# EAGLE design irng.2.0 (EAGLE 6.3)
Assembly variants: 3cpu, proto
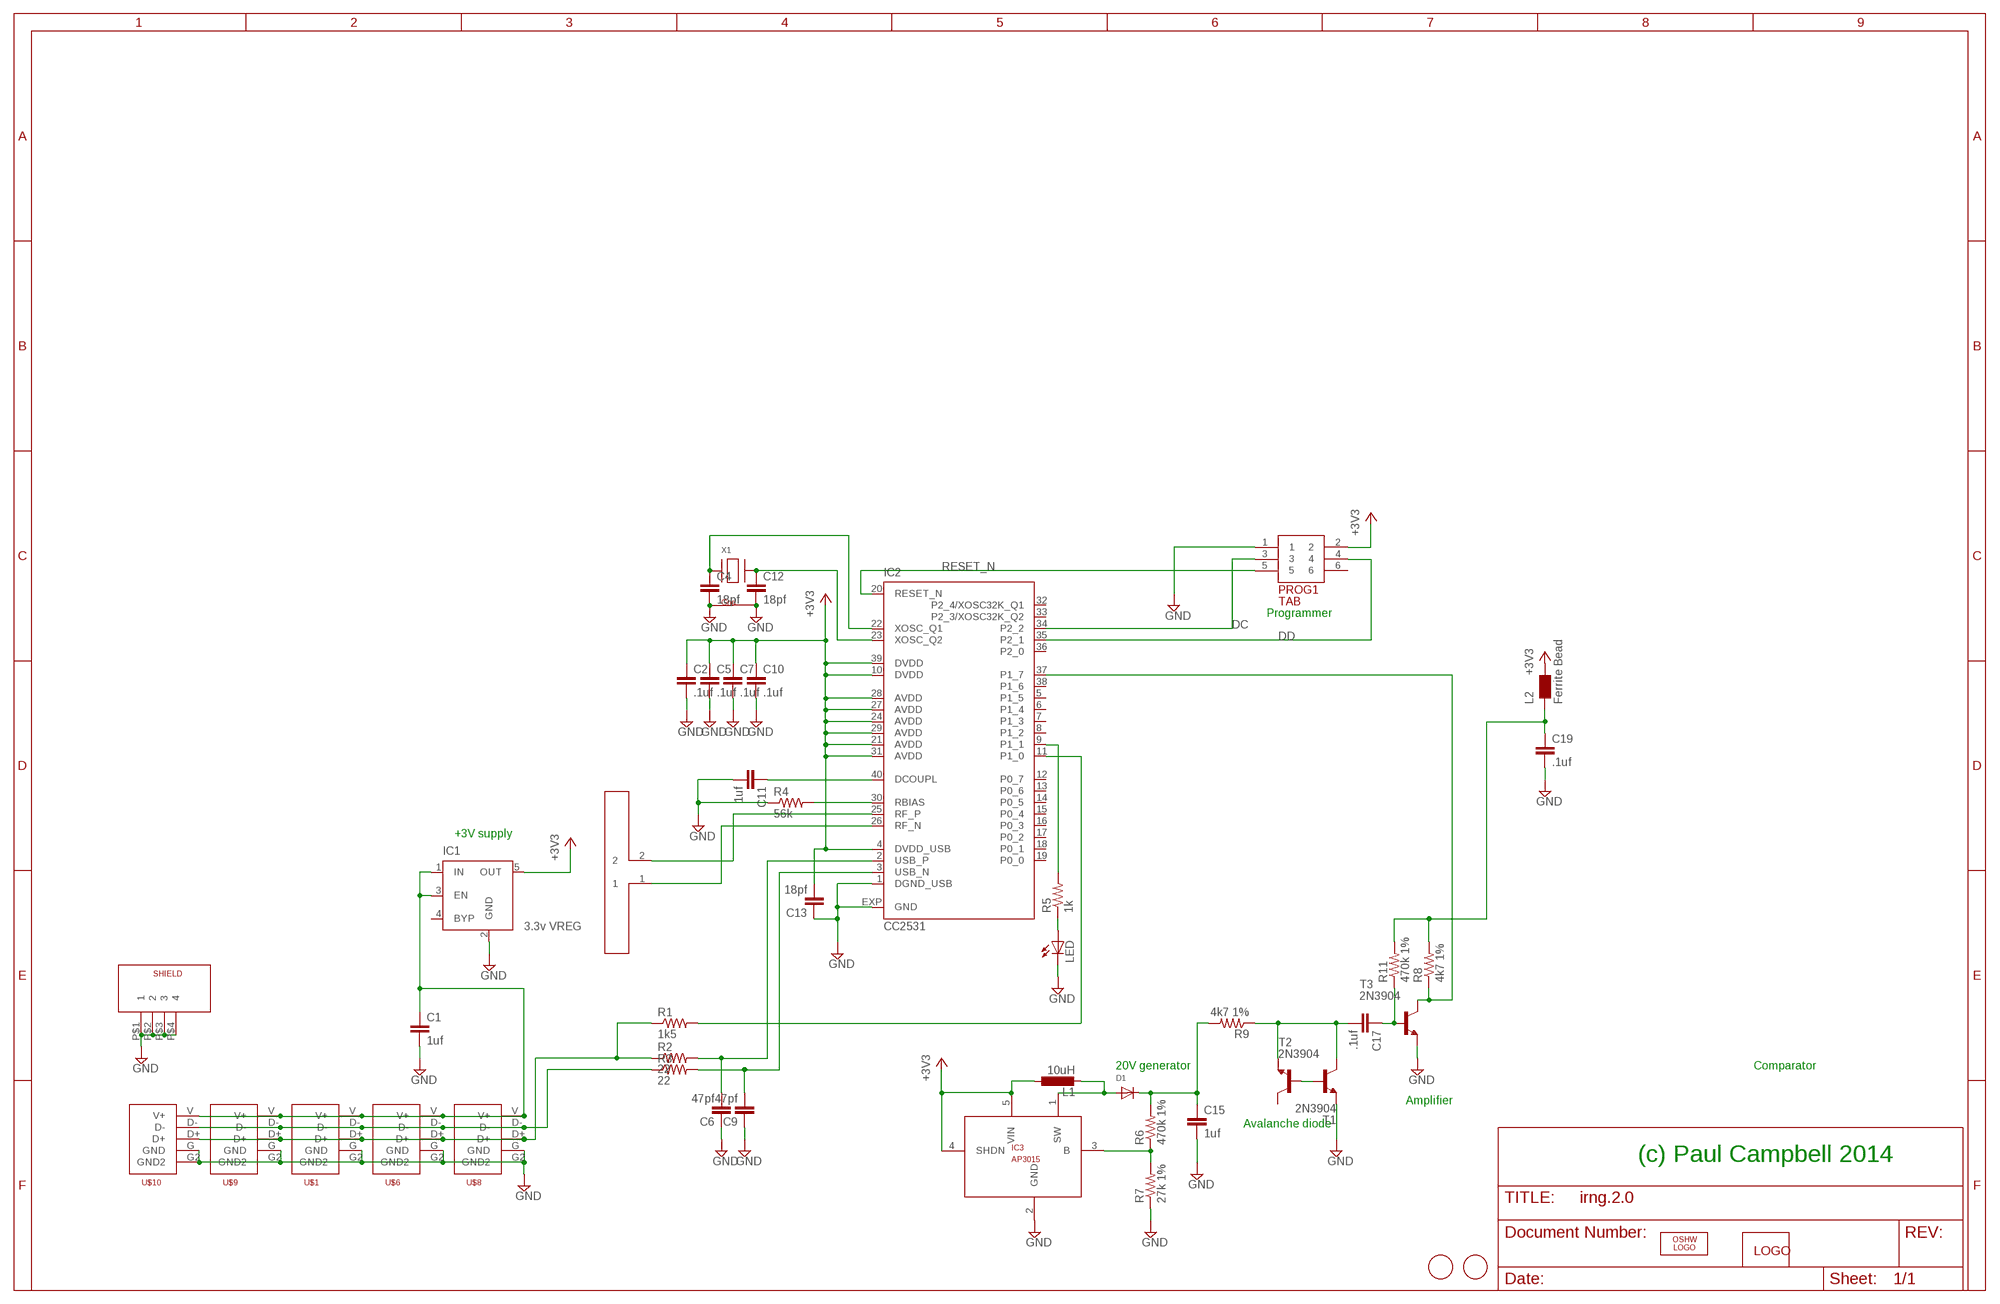
[diagram p0: schematic, sheet 1]

## Parts
C1  1uf  C-EUC0603  [C0603]
C2  .1uf  C-EUC0603  [C0603]
C4  18pf  C-EUC0603  [C0603]
C5  .1uf  C-EUC0603K  [C0603K]
C6  47pf  C-EUC0603  [C0603]
C7  .1uf  C-EUC0603  [C0603]
C9  47pf  C-EUC0603  [C0603]
C10  .1uf  C-EUC0603  [C0603]
C11  1uf  C-EUC0603  [C0603]
C12  18pf  C-EUC0603  [C0603]
C13  18pf  C-EUC0603  [C0603]
C15  1uf  C-EUC0603  [C0603]
C17  .1uf  C-EUC0603  [C0603]
C19  .1uf  C-EUC0603  [C0603]
D1  DIODESOD-323F  [SOD-323F]
IC1  3.3v VREG  MIC5219XX  [SOT23-5]
IC2  CC2531  [RHA_S-PVQFN-N40]
IC3  AP3015  AP3105  [SOT23-5]
L1  10uH  L-EUL2012C  [L2012C]
L2  Ferrite Bead  WE-CBF_0603  [0603]
LED  LEDCHIP-LED0805  [CHIP-LED0805]
LOGO1  OSHW_LOGO_FILLX0100-NT  [OSHW_FILLX100_NOTEXT]
PROG1  TAB  [TAG]
R1  1k5  R-US_R0603  [R0603]
R2  22  R-US_R0603  [R0603]
R3  22  R-US_R0603  [R0603]
R4  56k  R-US_R0603  [R0603]
R5  1k  R-US_R0603  [R0603]
R6  470k 1%  R-US_R0603  [R0603]
R7  27k 1%  R-US_R0603  [R0603]
R8  4k7 1%  R-US_R0603  [R0603]
R9  4k7 1%  R-US_R0603  [R0603]
R11  470k 1%  R-US_R0603  [R0603]
T1  2N3904  BCF32-NPN-SOT23-BEC  [SOT23-BEC]
T2  2N3904  BCF32-NPN-SOT23-BEC  [SOT23-BEC]
T3  2N3904  BCF32-NPN-SOT23-BEC  [SOT23-BEC]
U$1  USBPAD  [PAD4]
U$2  DIPOLE  [YSHORT-DIPOLE]
U$3  FIDUCIAL  [FIDUCIAL_1MM]
U$4  FIDUCIAL  [FIDUCIAL_1MM]
U$5  MOONBASE-LOGO  [MOONBASE-LOGO]
U$6  USBPAD  [PAD4]
U$7  SHIELD-NEW  [SHIELD-NEW]
U$8  USBPAD  [PAD4]
U$9  USBPAD  [PAD4]
U$10  USBPAD  [PAD4]
X1  XTAL-4-3225  [NX3225]

## Nets
+3V3: C2.1 C5.1 C7.1 C10.1 C13.2 IC1.5(OUT) IC2.4(DVDD_USB) IC2.10(DVDD) IC2.21(AVDD) IC2.24(AVDD) IC2.27(AVDD) IC2.28(AVDD) IC2.29(AVDD) IC2.31(AVDD) IC2.39(DVDD) IC3.4(SHDN) IC3.5(VIN) L1.1 L2.2 PROG1.2
DC: IC2.34(P2_2) PROG1.3
DD: IC2.35(P2_1) PROG1.4
GND: C1.2 C2.2 C4.2 C5.2 C6.1 C7.2 C9.1 C10.2 C11.2 C12.2 C13.1 C15.2 C19.2 IC1.2(GND) IC2.1(DGND_USB) IC2.EXP(GND) IC3.2(GND) LED.C PROG1.1 R4.1 R7.1 T2.E T3.E U$1.G2(GND2) U$1.G(GND) U$6.G2(GND2) U$6.G(GND) U$7.P$1 U$7.P$2 U$7.P$3 U$7.P$4 U$8.G2(GND2) U$8.G(GND) U$9.G2(GND2) U$9.G(GND) U$10.G2(GND2) U$10.G(GND) X1.2(G2) X1.4(G1)
N$1: T1.B T2.B
N$3: C6.2 IC2.2(USB_P) R2.2
N$4: R3.1 U$1.D- U$6.D- U$8.D- U$9.D- U$10.D-
N$5: C9.2 IC2.3(USB_N) R3.2
N$6: LED.A R5.1
N$7: R1.1 R2.1 U$1.D+ U$6.D+ U$8.D+ U$9.D+ U$10.D+
N$8: IC2.11(P1_0) R1.2
N$9: IC2.9(P1_1) R5.2
N$10: C11.1 IC2.40(DCOUPL)
N$11: IC2.37(P1_7) R8.1 T3.C
N$12: C1.1 IC1.1(IN) IC1.3(EN) U$1.V(V+) U$6.V(V+) U$8.V(V+) U$9.V(V+) U$10.V(V+)
N$13: C17.2 R9.1 T1.E T2.C
N$15: C17.1 R11.1 T3.B
N$16: C15.1 D1.C R6.2 R9.2
N$18: C4.1 IC2.22(XOSC_Q1) X1.1(X1)
N$19: C12.1 IC2.23(XOSC_Q2) X1.3(X2)
N$20: C19.1 L2.1 R8.2 R11.2
N$22: IC2.30(RBIAS) R4.2
N$24: IC2.25(RF_P) U$2.2
N$25: IC2.26(RF_N) U$2.1
N$27: D1.A IC3.1(SW) L1.2
R88: IC3.3(B) R6.1 R7.2
RESET_N: IC2.20(RESET_N) PROG1.5
Unconnected: IC1.4(BYP) IC2.5(P1_5) IC2.6(P1_4) IC2.7(P1_3) IC2.8(P1_2) IC2.12(P0_7) IC2.13(P0_6) IC2.14(P0_5) IC2.15(P0_4) IC2.16(P0_3) IC2.17(P0_2) IC2.18(P0_1) IC2.19(P0_0) IC2.32(P2_4/XOSC32K_Q1) IC2.33(P2_3/XOSC32K_Q2) IC2.36(P2_0) IC2.38(P1_6) PROG1.6 T1.C

## Notes on the sheet
- Programmer
- +3V supply
- 20V generator | Comparator
- Amplifier
- Avalanche diode
- (c) Paul Campbell 2014

## Library data of the parts
C1 C2 C4-C7 C9-C13 C15 C17 C19 = rcl:C-EU: CAPACITOR, European symbol
D1 = adafruit:DIODE: Diode SMADIODE - SMA Surface Mount Package 20V 1A Schottky Diode Digikey: 641-1014-6-ND DO-1N4148 - Through Hole Small Current Diode SOD-123 20V 1 A (.5mV Vf) Schottky Diode - Digikey: MBRX120TPMSCT-ND SOD-323 10V 570mA (.38mV Vf, 3ns) Schottky Diode - Digikey: ZLLS410CT-ND SOD-523 30V 30mA Schottky Diode (RB751S-40TE61) - Digikey: RB751S-40TE61CT-ND SOT23-R/W - SOT23 Package (R = Solder Paste/Reflow Ovens, W = Hand-Soldering) BAT54Film 40V 300mA - Digikey: 497-7162-1-ND
IC1 = v-reg-micrel:MIC5219XX: VOLTAGE REGULATOR
IC2 = texas:CC2531: A USB Enabled System-On-Chip Solution for 2.4-GHz IEEE 802.15.4 and ZigBee Source: http://focus.ti.com/lit/ds/symlink/cc2531.pdf; MPN: CC2531F256RHAT; OC_FARNELL: 1776351; OC_NEWARK: 34R2713
IC3 = playa:AP3105
L1 = rcl:L-EU: INDUCTOR, European symbol
L2 = wuerth-elektronik:WE-CBF: SMD EMI Suppression Ferrite Beads - excellent anti-EMI properties - low DCR - impedances till 3000 ohms - rated current up to 6 A
LED = adafruit:LED: LED OSRAM: - CHIPLED LG R971, LG N971, LY N971, LG Q971, LY Q971, LO R971, LY R971 LH N974, LH R974 LS Q976, LO Q976, LY Q976 LO Q996 - Hyper CHIPLED LW Q18S LB Q993, LB Q99A, LB R99A - SideLED LS A670, LO A670, LY A670, LG A670, LP A670 LB A673, LV A673, LT A673, LW A673 LH A674 LY A675 LS A676, LA A676, LO A676, LY A676, LW A676 LS A679, LY A679, LG A679 - Hyper Micro SIDELED® LS Y876, LA Y876, LO Y876, LY Y876 LT Y87S - SmartLED LW L88C, LW L88S LB L89C, LB L89S, LG L890 LS L89K, LO L89K, LY L89K LS L896, LA L896, LO L896, LY L896 - TOPLED LS T670, LO T670, LY T670, LG T670, LP T670 LSG T670, LSP T670, LSY T670, LOP T670, LYG T670 LG T671, LOG T671, LSG T671 LB T673, LV T673, LT T673, LW T673 LH T674 LS T676, LA T676, LO T676, LY T676, LB T676, LH T676, LSB T676, LW T676 LB T67C, LV T67C, LT T67C, LS T67K, LO T67K, LY T67K, LW E67C LS E67B, LA E67B, LO E67B, LY E67B, LB E67C, LV E67C, LT E67C LW T67C LS T679, LY T679, LG T679 LS T770, LO T770, LY T770, LG T770, LP T770 LB T773, LV T773, LT T773, LW T773 LH T774 LS E675, LA E675, LY E675, LS T675 LS T776, LA T776, LO T776, LY T776, LB T776 LHGB T686 LT T68C, LB T68C - Hyper Mini TOPLED® LB M676 - Mini TOPLED Santana® LG M470 LS M47K, LO M47K, LY M47K Source: http://www.osram.convergy.de/
LOGO1 = ohw-logo:OSHW_LOGO_FILL
PROG1 = br:TAB
R1-R9 R11 = rcl:R-US_: RESISTOR, American symbol
T1-T3 = transistor-neu-to92:*-NPN-: NPN Transistror
U$1 U$6 U$8-U$10 = playa:USBPAD
U$2 = playa:DIPOLE
U$3 U$4 = adafruit:FIDUCIAL: For use by pick and place machines to calibrate the vision/machine, 1mm By microbuilder.eu
U$5 = ll:MOONBASE-LOGO
U$7 = playa:SHIELD-NEW
X1 = adafruit:XTAL-4: Classic 4-pin 3.2 x 2.5mm crystal

## Board
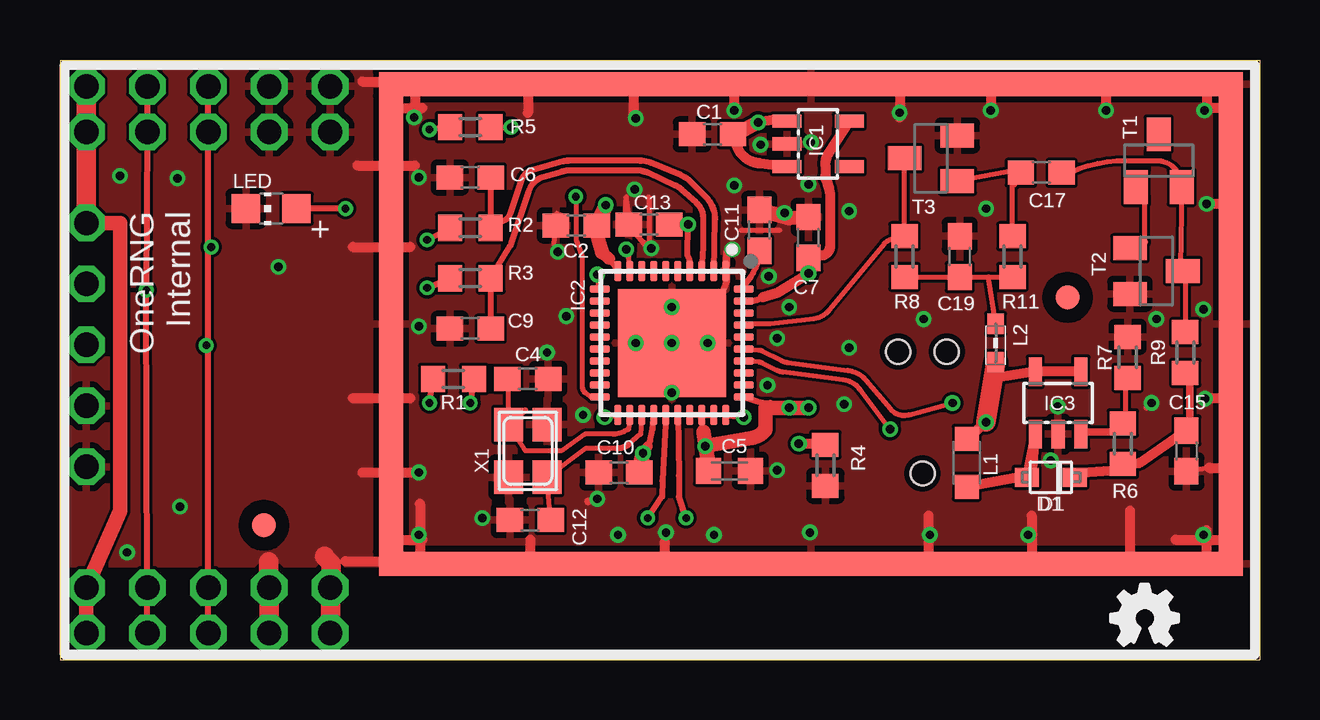
[diagram p1: board, top side]
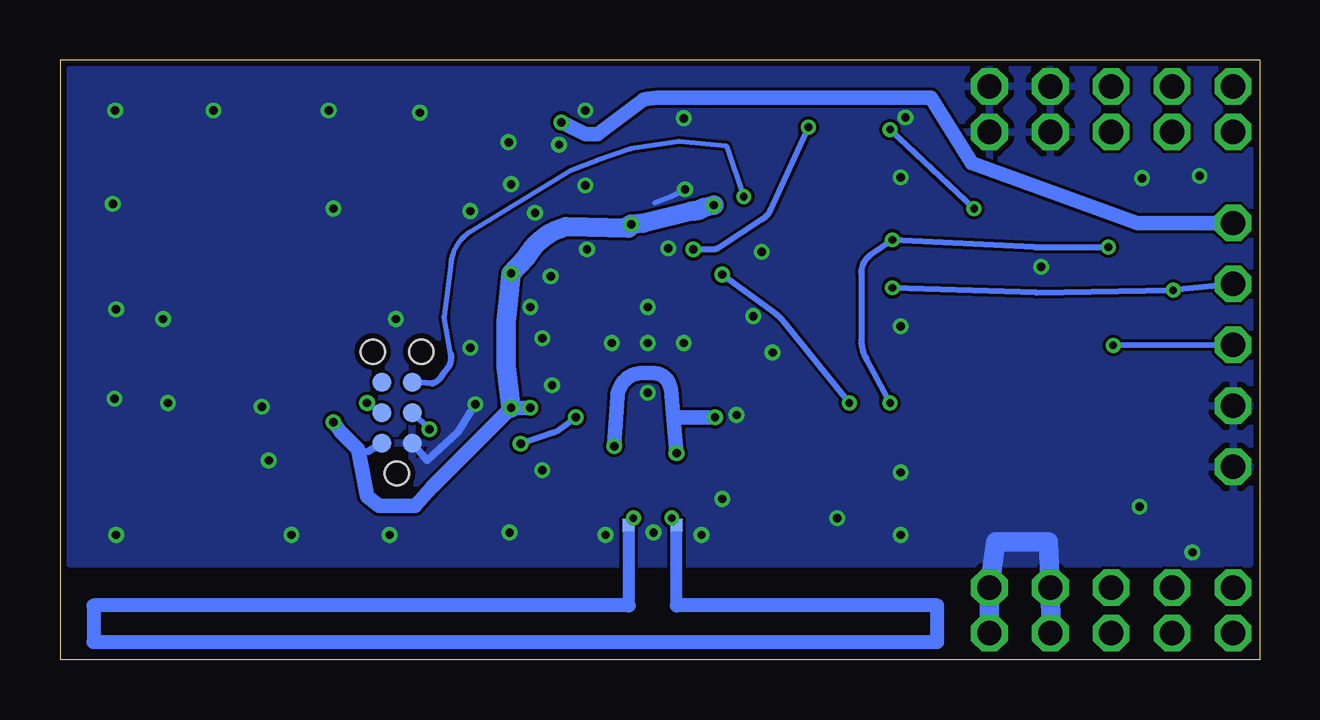
[diagram p2: board, bottom side, seen from below]

Size 50 x 25 mm. Coordinates in mm from the lower left corner, seen from the top.
Outline: 0,0 50,0 50,25 0,25 0,0
Copper layers (1*16): Top 0.035mm / dielectric 1.5mm / Bottom 0.035mm
Design rules "dirt_cheap_dirty_boards.v1": minimum track width 5mil, minimum drill 12mil, track to track 5mil, track to pad 5mil, pad to pad 5mil, via to via 5mil, smd to smd 0mil, copper to edge 10mil, drill to drill 10mil, minimum pad ring 10mil, minimum via ring 6mil, stop-mask expansion 2mil, vias tented up to drill 25mil, thermal gap 10mil

### Footprints (pad centres in the part's own frame; a part is rotated, then mirrored left to right if it is on the bottom)
C0603 = smd 1.1 x 1: 1 -0.85,0; 2 0.85,0
C0603K = smd 1.05 x 1.08: 1 -0.875,0; 2 0.875,0
SOD-323F = smd 1 x 0.8: A -1,0; C 1,0
SOT23-5 = smd 0.55 x 1.2: 1 -0.95,-1.3; 2 0,-1.3; 3 0.95,-1.3; 4 0.95,1.3; 5 -0.95,1.3
RHA_S-PVQFN-N40 = smd 0.85 x 0.3: 1 -3,2.25; 2 -3,1.75; 3 -3,1.25; 4 -3,0.75; 5 -3,0.25; 6 -3,-0.25; 7 -3,-0.75; 8 -3,-1.25; 9 -3,-1.75; 10 -3,-2.25; 21 3,-2.25; 22 3,-1.75; 23 3,-1.25; 24 3,-0.75; 25 3,-0.25; 26 3,0.25; 27 3,0.75; 28 3,1.25; 29 3,1.75; 30 3,2.25 | smd 0.3 x 0.85: 11 -2.25,-3; 12 -1.75,-3; 13 -1.25,-3; 14 -0.75,-3; 15 -0.25,-3; 16 0.25,-3; 17 0.75,-3; 18 1.25,-3; 19 1.75,-3; 20 2.25,-3; 31 2.25,3; 32 1.75,3; 33 1.25,3; 34 0.75,3; 35 0.25,3; 36 -0.25,3; 37 -0.75,3; 38 -1.25,3; 39 -1.75,3; 40 -2.25,3 | smd 4.5 x 4.5: EXP 0,0
L2012C = smd 1 x 1: 1 -1,0; 2 1,0
0603 = smd 0.85 x 0.7: 1 -0.9,0; 2 0.7,0
CHIP-LED0805 = smd 1.2 x 1.2: A 0,-1.05; C 0,1.05
TAG = smd 0.787 x 0.787 bottom: 1 -1.27,0.635; 2 -1.27,-0.635; 3 0,0.635; 4 0,-0.635; 5 1.27,0.635; 6 1.27,-0.635 | hole 1: -2.54,0; 2.54,1.016; 2.54,-1.016
R0603 = smd 1 x 1.1: 1 -0.85,0; 2 0.85,0
SOT23-BEC = smd 1 x 1.4: B -0.95,-1.1; C 0,1.1; E 0.95,-1.1
PAD4 = drill 1.016 octagon: D+ -5.08,0; D- -2.54,0; G -7.62,0; G2 -10.16,0; V 0,0
YSHORT-DIPOLE = smd 0.51 x 0.51 bottom: 1 -1,0; 2 1,0
FIDUCIAL_1MM = smd 1 x 1: 1 0,0
SHIELD-NEW = smd 1 x 20: P$1 17.5,0; P$2 -17.5,0 | smd 36 x 1: P$3 0,10; P$4 0,-10
NX3225 = smd 1.4 x 1.2: 1 -1.1,-0.8; 2 1.1,-0.8; 3 1.1,0.8; 4 -1.1,0.8

### Placement (x,y rotation side)
C1  27.2,21.9 180 top
C2  21.52,18.1 180 top
C4  19.5,11.7 0 top
C5  27.9,7.87 0 top
C6  17.1,20.1 0 top
C7  31.2,17.6 90 top
C9  17.1,13.8 0 top
C10  23.3,7.8 180 top
C11  29.15,17.9 90 top
C12  19.6,5.82 180 top
C13  24.55,18.13 0 top
C15  46.95,8.7 270 top
C17  40.9,20.3 0 top
C19  37.5,16.8 90 top
D1  41.3,7.6 0 top
IC1  31.6,21.5 270 top
IC2  25.5,13.2 270 top
IC3  41.6,10.7 0 top
L1  37.8,8.2 270 top
L2  39,13.1 270 top
LED  8.8,18.8 90 top
LOGO1  43.8,0.6 0 top
PROG1  35.95,10.3 90 top
R1  16.4,11.7 0 top
R2  17.1,18 0 top
R3  17.1,15.9 0 top
R4  31.9,8.1 90 top
R5  17.1,22.2 0 top
R6  44.3,9 270 top
R7  44.5,12.6 270 top
R8  35.2,16.8 270 top
R9  46.9,12.8 270 top
R11  39.7,16.8 270 top
T1  45.8,20.8 0 top
T2  45.7,16.2 270 top
T3  36.3,20.9 90 top
U$1  1.1,1.1 180 top
U$2  25.3,5.6 180 top
U$3  42,15.1 0 top
U$4  8.5,5.6 0 top
U$5  13.4,6.8 90 top
U$6  1.1,23.9 180 top
U$7  31.3,14 0 top
U$8  1.1,3 180 top
U$9  1.1,22 180 top
U$10  1.1,18.2 90 top
X1  19.5,8.7 270 top

### Tracks (layer width: path | path; a pad name or v marks a point on that pad's centre or on a via)
+3V3  (via drill 0.35)
  Top 0.2: v38.6,9.9 38.6,9.7
  Top 0.254: 26.7,10.2 IC2.28 IC2.29 | 26.7,10.2 IC2.27 | 26.83,9.5 26.8,9.7 26.7,10.2 | 27,8.3 C5.1 | 22.9,16.7 IC2.10 | IC2.39 28.77,14.95 arc29 29.29,15.11 | 24.5,8.9 24.6,9.1 24.7,9.6 IC2.24 | IC2.21 v22.7,10.1 | IC2.31 29.3,10.7 29.6,10.7 v31.2,10.5 | v31.2,16.1 31.3,17.1 C7.1 | IC2.4 26.25,16.55 arc34 26.17,16.83 v26.18,18.15
  Top 0.406: 29.29,15.11 29.9,15.3 v31.2,16.1 | 24.5,8.9 v24.3,8.6 | C13.2 v26.18,18.15 | IC3.4 IC3.5 38.7,11.7 v38.6,9.9 L1.1 | 32.6,22.4 IC1.5 32.05,21.14 arc33 31.9,20.62 31.9,20.17 arc18 31.92,20.03 32.05,19.64 arc-18 32.1,19.35 32.1,17.24 arc-81 31.77,16.84 C7.1
  Top 0.5: 22.6,17 22.9,16.7
  Top 0.61: v26.9,8.9 27,8.2 27,8.3 v26.9,8.9 | v31.2,10.5 29.4,10.5 29.4,9.6 arc-46 28.84,9.24 v26.9,8.9 | v26.9,8.9 26.87,8.92 | 22.6,17 22.3,18 v22.75,18.95 22.5,18.3 C2.1 | C10.1 24.1,7.8 v24.3,8.6 | 26.83,9.5 v26.9,8.9 | C7.1 v31.2,16.1
  Top 0.813: L2.2 v38.6,9.9
  Bottom 0.2: 37.15,8.67 37.58,8.76
  Bottom 0.254: 24.2,10.1 24.36,9.29
  Bottom 0.305: PROG1.2 37.15,8.67
  Bottom 0.406: 24.2,8.7 v24.3,8.6
  Bottom 0.61: v24.3,8.6 24.36,9.29 24.54,11.26 arc-85 25.29,11.95 25.71,11.95 arc-86 26.77,10.96 v26.9,8.9 | 24.2,10.1 v22.7,10.1 | v30.4,10.5 v31.2,10.5 | v31.2,10.5 31.3,10.5 | 31.4,14.04 31.4,14.1 | v31.2,10.5 34.5,7.2 35.2,6.4 36.7,6.4 37.2,6.8 37.4,7.9 37.58,8.76 38.3,9.5 v38.6,9.9
  Bottom 0.813: 31.4,14.04 arc11 31.4,13.97 31.4,12.22 v31.2,10.5 | v22.75,18.95 23.16,18.84 arc31 23.68,18.7 25.7,18.2 v26.18,18.15 | 26.25,18.11 v26.18,18.15 | v26.18,18.15 26.3,18 28.9,18.05 arc-46 30.59,16.75 v31.2,16.1 31.32,14.85 31.4,14.1
DC  (via drill 0.35)
  Top 0.2: IC2.34 29.14,12.4 arc-22 29.26,12.37 29.89,12.05 arc19 30.12,11.98 32.65,11.66 arc-46 33.37,11.24 v34.6,9.6
  Top 0.254: IC2.34 28.85,12.45 | v34.6,9.6 34.57,9.62
  Bottom 0.254: PROG1.3 v34.6,9.6
DD  (via drill 0.35)
  Top 0.2: IC2.35 29.13,12.9 arc-22 29.26,12.87 30.07,12.47 arc19 30.35,12.38 32.84,12.06 arc-42 33.6,11.64 34.62,10.45 arc65 35.38,10.21 v37.2,10.7
  Bottom 0.254: v37.2,10.7 PROG1.4
GND  (via drill 0.35)
  Top 0.2: 22.1,7.8 22.5,7.8 | 24.55,19.3 24.55,17.1 23.8,18 23.6,19.3 23.5,18.2 24.55,17.2 | v20.75,17 20.6,17.3 20.7,18.6 | 20.7,18.6 21.1,18.5 | C2.2 20.7,18.6 | 28.4,17.9 30,17.9 | 47.9,8 C15.2
  Top 0.254: 27.8,16.4 IC2.1 27.8,16.1 27.8,15.8 27.5,15.1 | 45.3,10.5 v45.5,10.7 | 25.2,4.9 v25.26,5.3
  Top 0.305: 22,6.6 v22.4,6.7 | v28.03,17.1 27.8,17 IC2.1
  Top 0.406: 12.6,24.1 15,24.1 | 11.9,4.1 14.3,4.1 | 12.6,7.8 15,7.8 | 12.2,10.9 14.6,10.9 | 15,6.5 15,4.1 | 19.6,5 19.6,4.2 | 36.2,6 36.2,3.8 | 40.5,6 40.5,3.9 | 44.6,6.2 44.6,3.8 | 46.5,5 48.9,5 | 47.9,8 49,8 | 47.8,10.9 49,10.9 | 47.8,4.3 47.8,5.4 | 48.9,19 v47.8,19 | 49,23 47.8,23 | 47.8,23.9 47.8,23 | 47.8,23 47.8,22.8 | 38.8,23.9 38.8,22.8 | 43.6,23.9 43.6,22.8 | 35,23.7 35,22.6 | 28.1,23.9 28.1,22.8 | 23.9,23.8 23.9,22.7 | 19.5,23.9 19.5,22.8 | 14.8,23.8 14.8,22.7 | 14,23 15.1,23 | 14,5 15.1,5 | 12.2,17.2 14.6,17.2 | 12.4,20.6 14.8,20.6 | 25.2,4.9 25.2,4.1
  Top 0.61: C11.2 30.4,18.4 C7.2
  Top 0.813: U$1.G 8.69,4.08 | 11.03,4.3 11.31,3.99 U$1.G2
  Bottom 0.2: 25.2,19.05 24.55,19.3 v23.95,19.6
  Bottom 0.305: PROG1.1 34.7,8.3 33.4,9.5 v32.69,10.64
  Bottom 0.813: U$1.G2 U$8.G2 11,4.9 8.8,4.9 U$8.G 8.7,1.3
  other vias: 25.5,14.7 25.5,11.12 27,13.2 24,13.2 29.9,7.9 21.8,10.2 29.49,11.44 30.2,18.62 25.5,13.2 31.2,19.82 45.7,14.2 29.55,15.98 21.1,14.32 38.6,18.8 43.6,22.9 24.65,17.15 41.59,10.54 41.3,8.3 32.9,13 30.4,14.7 29.9,13.4 2.5,20.17 20.3,12.8 28.1,19.77 38.8,22.9 36,14.2 47.73,10.87 47.7,22.9 24,22.57 17.6,5.9 14.76,22.6 29.2,21.47 31.3,21.57 32.9,18.7 9.1,16.37 35,22.8 28.1,22.9 14.96,20.1 14.96,13.9 14.96,5.2 23.26,5.2 14.96,7.8 36.26,5.2 40.36,5.2 47.66,5.2 47.66,14.6 31.26,5.3 5,6.37 2.8,4.47 27.26,5.2 4.9,20.07
  pour Top: 0.34,24.6 49.6,24.6 49.6,4 0.4,4
  pour Bottom: 0.4,4 49.6,4 49.6,24.6 0.4,24.6
N$1
  Top 0.2: 45.2,19.3 45.2,17.4
  Top 0.305: T1.B 45.2,19.3 | 45.2,17.4 T2.B
N$3
  Top 0.254: IC2.2 27.31,18.34 arc46 26.95,19.25 26.27,19.94 arc20 25.89,20.19 24.62,20.71 arc22 24.16,20.8 21.2,20.8 arc16 21,20.77 19.7,20.41 arc60 19.2,19.9 18.76,18.59 arc-43 18.52,18.31 R2.2 C6.2
N$4  (via drill 0.32)
  Top 0.254: v15.3,15.5 R3.1 | U$6.D- U$9.D- v3.6,15.4 U$8.D- U$1.D-
  Bottom 0.254: v15.3,15.5 9.3,15.3 v3.6,15.4 U$10.D-
N$5
  Top 0.254: IC2.3 26.82,17.2 26.82,18.39 arc48 26.53,19.04 25.92,19.6 arc17 25.66,19.77 24.52,20.3 arc25 24.05,20.4 21.28,20.4 arc16 20.92,20.35 20.17,20.13 arc56 19.55,19.54 18.82,17.36 arc-13 18.77,17.25 R3.2 C9.2
N$6  (via drill 0.32)
  Top 0.254: R5.1 v15.4,22.1 | v11.9,18.8 LED.A
  Bottom 0.254: v15.4,22.1 v11.9,18.8
N$7  (via drill 0.32)
  Top 0.254: v15.3,17.5 R2.1 | v15.4,10.7 R1.1 | U$1.D+ U$8.D+ 6.18,13 | 6.18,13 6.18,17.1 | 6.18,17.1 U$9.D+ U$6.D+ | v6.3,17.2 6.18,17.1 | v6.1,13.1 6.18,13
  Bottom 0.254: v15.4,10.7 16.39,12.52 arc29 16.6,13.33 16.6,16.13 arc55 16.21,16.87 v15.3,17.5 9.4,17.2 v6.3,17.2 | U$10.D+ v6.1,13.1
N$8  (via drill 0.32, 0.35)
  Top 0.254: IC2.11 v22.4,16.05 | R1.2 v17.1,10.7
  Bottom 0.254: v17.1,10.7 19.8,14.05 arc-15 20.26,14.49 v22.4,16.05
N$9  (via drill 0.32, 0.35)
  Top 0.2: IC2.9 23.7,16.8 v23.6,17.1
  Top 0.254: R5.2 v18.8,22.2
  Bottom 0.254: v23.6,17.1 22.78,17.1 arc-33 22.56,17.16 20.73,18.35 arc-32 20.39,18.74 v18.8,22.2
N$10
  Top 0.254: C11.1 arc-43 28.42,15.52 IC2.40
N$11
  Top 0.2: IC2.37 28.9,14 29.6,14 31.42,14.2 arc44 32.08,14.6 34.36,17.34 arc-43 34.71,17.52 34.93,17.54 R8.1 T3.C
N$12  (via drill 0.35)
  Top 0.406: 28.26,21.95 28.1,21.7 28.19,21.48 arc72 29.19,20.69 IC1.3 | IC1.1 29.7,22.5 v29.1,22.4
  Top 0.61: v29.1,22.4 28.26,21.95 C1.1 | U$1.V U$8.V 2.5,6.2 | 2.5,6.2 2.5,18.2 | 2.5,18.2 U$10.V | 2.5,6.2 2.5,18.2
  Top 0.813: U$6.V U$9.V U$10.V
  Bottom 0.61: v29.1,22.4 28.1,21.9 27.6,21.9 25.68,23.34 arc12 25.12,23.42 13.7,23.42 12,20.7 5.1,18.2 U$10.V
N$13
  Top 0.2: T2.C 46.7,16.4 T1.E 46.52,20.43 arc49 45.71,20.8 44.45,20.8 arc26 42.1,20.3 C17.2 | 47.1,16.4 46.9,15.9 R9.1
  Top 0.305: T2.C 47.1,16.4
N$15
  Top 0.2: R11.1 39.7,20.1 39.8,20.1 | 39.8,20.1 39.8,20.4 39.9,20.4 T3.B | C17.1 39.8,19.8 39.8,20.1
N$16
  Top 0.305: R9.2 47.1,11.8 47.1,9.9 C15.1
  Top 0.406: D1.C 42.6,7.8 44.1,7.9 R6.2 45,8.2 C15.1
N$18
  Top 0.2: IC2.22 23.7,9.6 23.52,9.51 arc-27 23.06,9.4 21.88,9.4 20.9,8.7 19.4,8.7 X1.1 C4.1
  Top 0.254: X1.1 19.4,10.4
N$19
  Top 0.2: IC2.23 24.2,9.4 23.7,8.97 | 23.24,8.8 21.9,8.8 X1.3 C12.1
  Top 0.254: 23.7,8.97 arc-41 23.24,8.8
N$20
  Top 0.2: L2.1 38.7,15.95 R11.2 C19.1 R8.2
N$22  (via drill 0.35)
  Top 0.254: IC2.30 v28.5,10.1 | 31.9,9 32,8.9 R4.2
  Top 0.406: 31.9,9 v30.8,9
  Bottom 0.254: v28.5,10.1 29.21,9.57 arc18 29.41,9.46 v30.8,9
N$24  (via drill 0.32)
  Top 0.254: IC2.25 25.11,7.47 25.1,6.8 v24.5,5.9
  Bottom 0.254: U$2.2 v24.5,5.9
N$25  (via drill 0.32)
  Top 0.254: IC2.26 25.8,7.66 25.8,6.8 v26.1,5.9
  Bottom 0.254: U$2.1 v26.1,5.9
N$27
  Top 0.406: 40,7.5 40.5,7.7 | 40.5,7.7 IC3.1 D1.A | 40.5,7.7 L1.2
R88
  Top 0.2: R7.2 44.4,11.6 44.4,10 R6.1
  Top 0.305: IC3.3 42.5,9.5 44.1,9.5 R6.1
RESET_N  (via drill 0.32)
  Top 0.2: IC2.20 22.07,10.99 21.91,11.11 arc-52 21.78,11.35 21.78,16.8 21.53,17.5 21.53,19.5 v21.5,19.3
  Bottom 0.2: 33.72,12.75 34,14.3 33.71,16.56 arc49 32.93,17.81 28.7,20.4 27.65,20.8 26.2,21.3 24.2,21.6 22.2,21.4 v21.5,19.3
  Bottom 0.254: 33.72,12.75 arc33 33.77,12.27 34.07,11.86 arc45 34.48,11.51 PROG1.5

### Text on the board
tNames: OneRNG / Internal
tDocu: V2.0 | (C) Paul Campbell 2014
_tPlace: IC3
_tNames: C1 | R5 | IC1 | T1 | LED | C6 | C13 | T3 | C17 | R2 | C2 | C11 | R3 | T2 | IC2 | C7 | R8 | C19 | R11 | C9 | L2 | R7 | C4 | R9 | R1 | C15 | X1 | C10 | C5 | L1 | R4 | R6 | C12 | D1